# Altium schematic sheet ESP32 and Sensor.SchDoc
size B; SheetNumber: 2; SheetTotal: 4
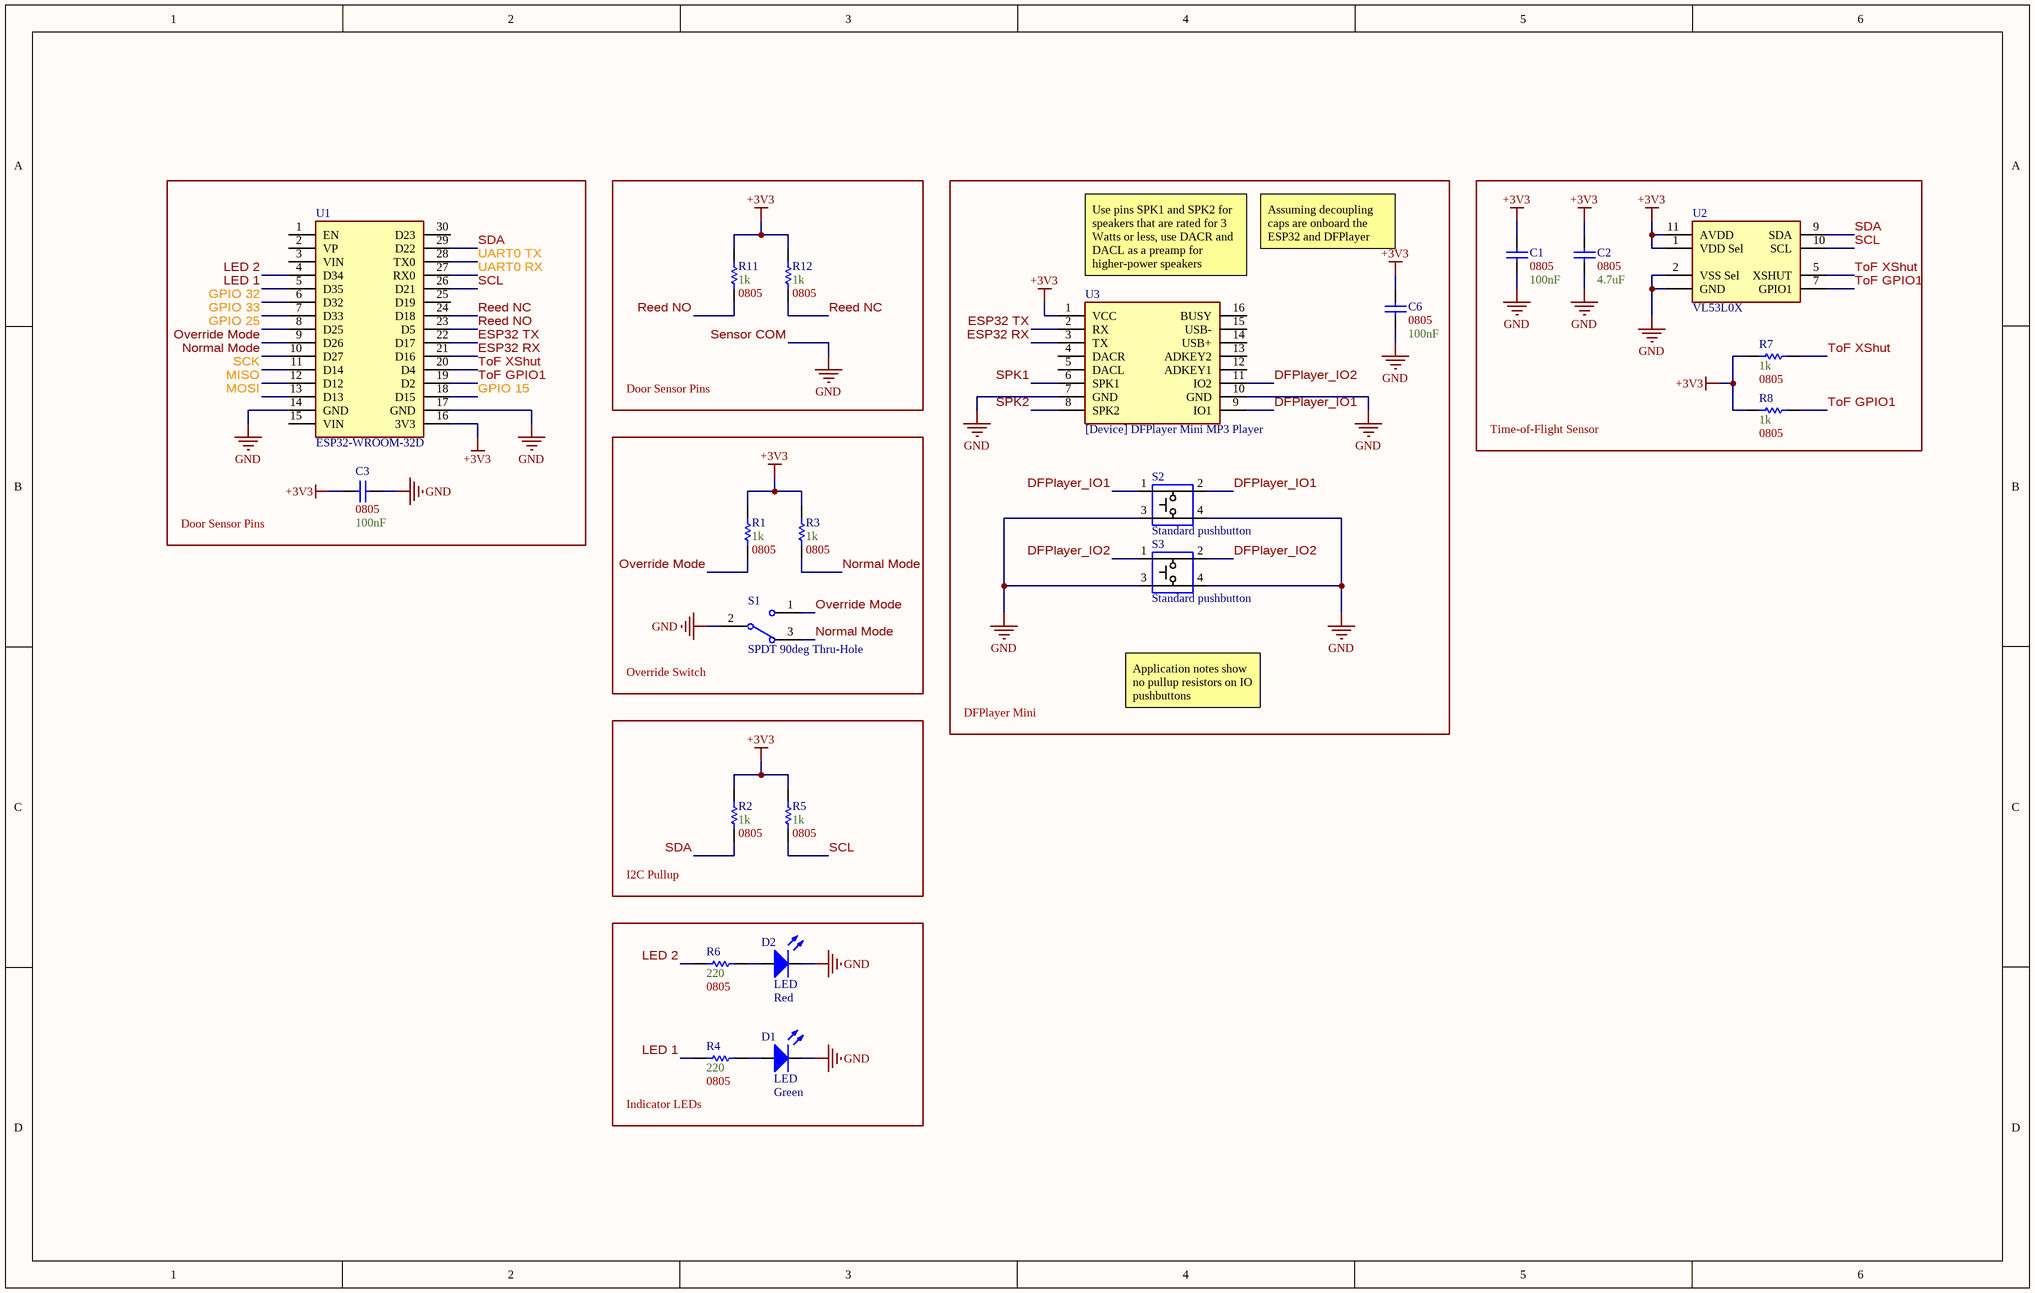
[diagram p0: ESP32 and Sensor.SchDoc]

## Parts
C1  Size Package: 0805  Capacitance: 100nF  [[Cap] SMD 0805]  (hidden comment: SMD Nonpolarized)
C2  Size Package: 0805  Capacitance: 4.7uF  [[Cap] SMD 0805]  (hidden comment: SMD Nonpolarized)
C3  Size Package: 0805  Capacitance: 100nF  [[Cap] SMD 0805]  (hidden comment: SMD Nonpolarized)
C6  Size Package: 0805  Capacitance: 100nF  [[Cap] SMD 0805]  (hidden comment: SMD Nonpolarized)
D1  LED  Color: Green  [[LED] Thru-Hole, 3mm, Green]
D2  LED  Color: Red  [[LED] Thru-Hole, 3mm, Red]
R1  Resistance: 1k  Size Package: 0805  [[Res] SMD 0805]  (hidden comment: [Res] SMD Resistor)
R2  Resistance: 1k  Size Package: 0805  [[Res] SMD 0805]  (hidden comment: [Res] SMD Resistor)
R3  Resistance: 1k  Size Package: 0805  [[Res] SMD 0805]  (hidden comment: [Res] SMD Resistor)
R4  Resistance: 220  Size Package: 0805  [[Res] SMD 0805]  (hidden comment: [Res] SMD Resistor)
R5  Resistance: 1k  Size Package: 0805  [[Res] SMD 0805]  (hidden comment: [Res] SMD Resistor)
R6  Resistance: 220  Size Package: 0805  [[Res] SMD 0805]  (hidden comment: [Res] SMD Resistor)
R7  Resistance: 1k  Size Package: 0805  [[Res] SMD 0805]  (hidden comment: [Res] SMD Resistor)
R8  Resistance: 1k  Size Package: 0805  [[Res] SMD 0805]  (hidden comment: [Res] SMD Resistor)
R11  Resistance: 1k  Size Package: 0805  [[Res] SMD 0805]  (hidden comment: [Res] SMD Resistor)
R12  Resistance: 1k  Size Package: 0805  [[Res] SMD 0805]  (hidden comment: [Res] SMD Resistor)
S1  SPDT 90deg Thru-Hole  [[Switch] SPDT Toggle Switch 90deg]
S2  Standard pushbutton  [[Switch] Pushbutton]
S3  Standard pushbutton  [[Switch] Pushbutton]
U1  ESP32-WROOM-32D  [[Device] ESP32-WROOM-32D]
U2  VL53L0X  [[Device] Time-of-Flight Sensor]
U3  [Device] DFPlayer Mini MP3 Player  [[Device] DFPlayer Mini MP3 Player]

## Blocks framed on the sheet
Door Sensor Pins: C3 U1
Door Sensor Pins: R11 R12
DFPlayer Mini: C6 S2 S3 U3
Time-of-Flight Sensor: C1 C2 R7 R8 U2
Override Switch: R1 R3 S1
I2C Pullup: R2 R5
Indicator LEDs: D1 D2 R4 R6

## Nets
+3V3: C1.2 C2.2 C3.2 C6.2 R1.2 R2.2 R3.2 R5.2 R7.2 R8.2 R11.2 R12.2 U1.16(3V3) U2.1(VDD_Sel) U2.11(AVDD) U3.1(VCC)
Sensor COM: C1.1 C2.1 C3.1 C6.1 D1.2(K) D2.2(K) S1.2 S2.3 S2.4 S3.3 S3.4 U1.14(GND) U1.17(GND) U2.2(VSS_Sel) U2.GND U3.7(GND) U3.10(GND)  [also labelled GND]
DFPlayer_IO1: S2.1 S2.2 U3.9(IO1)
DFPlayer_IO2: S3.1 S3.2 U3.11(IO2)
ESP32 RX: U1.21(D16) U3.3(TX)
ESP32 TX: U1.22(D17) U3.2(RX)
GPIO 15: U1.18(D15)
GPIO 25: U1.8(D25)
GPIO 32: U1.6(D32)
GPIO 33: U1.7(D33)
LED 1: R4.1 U1.5(D35)
LED 2: R6.1 U1.4(D34)
MISO: U1.12(D12)
MOSI: U1.13(D13)
Normal Mode: R3.1 S1.3 U1.10(D27)
Override Mode: R1.1 S1.1 U1.9(D26)
Reed NC: R12.1 U1.24(D18)
Reed NO: R11.1 U1.23(D5)
SCK: U1.11(D14)
SCL: R5.1 U1.26(D21) U2.10(SCL)
SDA: R2.1 U1.29(D22) U2.9(SDA)
SPK1: U3.6(SPK1)
SPK2: U3.8(SPK2)
ToF GPIO1: R8.1 U1.19(D2) U2.7(GPIO1)
ToF XShut: R7.1 U1.20(D4) U2.5(XSHUT)
UART0 RX: U1.27(RX0)
UART0 TX: U1.28(TX0)
NetD1_1: D1.1(A) R4.2
NetD2_1: D2.1(A) R6.2

Not connected (* = marked no-connect by the designer): U1 1(EN) 2(VP) 3(VIN) 15(VIN) 25(D19) 30(D23); U3 4(DACR) 5(DACL) 12(ADKEY1) 13(ADKEY2) 14(USB+) 15(USB-) 16(BUSY)

## Notes on the sheet
- (near U3) Use pins SPK1 and SPK2 for speakers that are rated for 3 Watts or less, use DACR and DACL as a preamp for higher-power speakers
- Assuming decoupling caps are onboard the ESP32 and DFPlayer
- Application notes show no pullup resistors on IO pushbuttons

## Library data of the parts
C1-C3 C6 = [Cap] SMD Nonpolarized
D1 D2 = [LED] Thru-Hole 3mm: 3mm LED
R1-R8 R11 R12 = [Res] SMD Resistor: Generic
S1 = [Switch] SPDT Toggle Switch 90deg: 100SP1T2B4M6QE
S2 S3 = [Switch] Pushbutton
U1 = [Device] ESP32-WROOM-32D: ESP32 DEVKIT V1 - DOIT; ComponentLink1Description: Pinout; ComponentLink1URL: https://esp32.com/viewtopic.php?t=9875
U2 = [Device] Time-of-Flight Sensor: VL53L0CXV0DH/1
U3 = [Device] DFPlayer Mini MP3 Player: ComponentLink1Description: Datasheet; ComponentLink1URL: https://picaxe.com/docs/spe033.pdf